# EAGLE design dice (EAGLE 5.11)
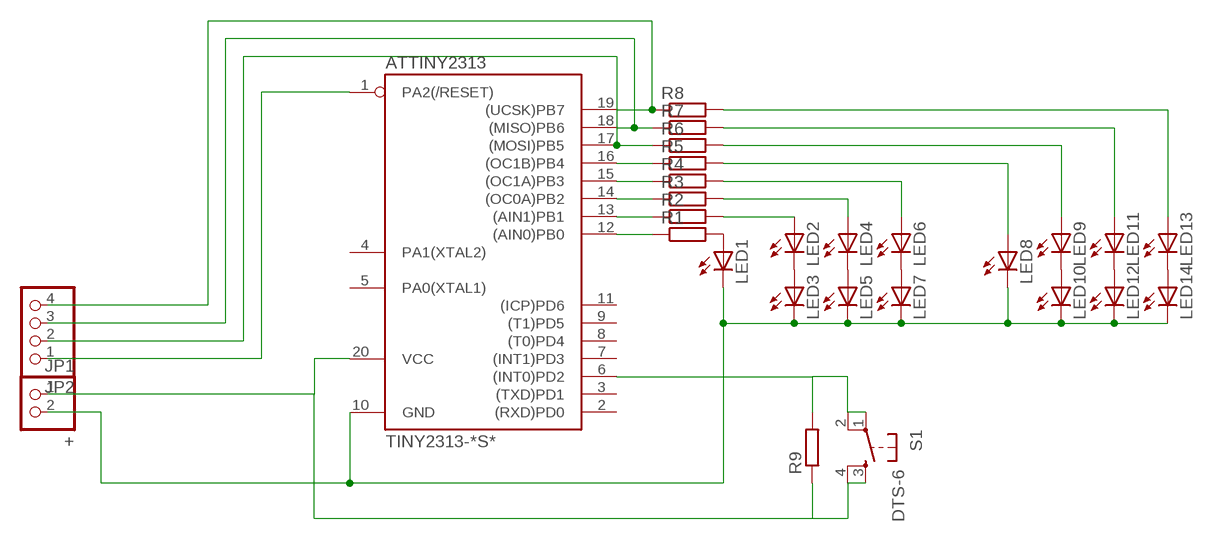
[diagram p0: schematic, sheet 1]

## Parts
ATTINY2313  TINY2313-*S*  [SO20L$]
JP1  +  PINHD-1X2/90  [1X02/90]
JP2  PINHD-1X4/90  [1X04/90]
LED1  LEDCHIPLED_1206  [CHIPLED_1206]
LED2  LEDCHIPLED_1206  [CHIPLED_1206]
LED3  LEDCHIPLED_1206  [CHIPLED_1206]
LED4  LEDCHIPLED_1206  [CHIPLED_1206]
LED5  LEDCHIPLED_1206  [CHIPLED_1206]
LED6  LEDCHIPLED_1206  [CHIPLED_1206]
LED7  LEDCHIPLED_1206  [CHIPLED_1206]
LED8  LEDCHIPLED_1206  [CHIPLED_1206]
LED9  LEDCHIPLED_1206  [CHIPLED_1206]
LED10  LEDCHIPLED_1206  [CHIPLED_1206]
LED11  LEDCHIPLED_1206  [CHIPLED_1206]
LED12  LEDCHIPLED_1206  [CHIPLED_1206]
LED13  LEDCHIPLED_1206  [CHIPLED_1206]
LED14  LEDCHIPLED_1206  [CHIPLED_1206]
R1  R-EU_R0402  [R0402]
R2  R-EU_R0402  [R0402]
R3  R-EU_R0402  [R0402]
R4  R-EU_R0402  [R0402]
R5  R-EU_R0402  [R0402]
R6  R-EU_R0402  [R0402]
R7  R-EU_R0402  [R0402]
R8  R-EU_R0402  [R0402]
R9  R-EU_0207/10  [0207/10]
S1  DTS-6  [DTS-6]

## Nets
+5V: ATTINY2313.20(VCC) JP1.1 R9.1 S1.3 S1.4
N$1: ATTINY2313.12((AIN0)PB0) R1.1
N$2: ATTINY2313.13((AIN1)PB1) R2.1
N$3: ATTINY2313.14((OC0A)PB2) R3.1
N$4: ATTINY2313.15((OC1A)PB3) R4.1
N$5: ATTINY2313.16((OC1B)PB4) R5.1
N$7: ATTINY2313.18((MISO)PB6) JP2.3 R7.1
N$8: ATTINY2313.19((UCSK)PB7) JP2.4 R8.1
N$9: LED1.A R1.2
N$10: LED2.C LED3.A
N$11: LED4.C LED5.A
N$12: LED6.C LED7.A
N$13: LED2.A R2.2
N$14: LED4.A R3.2
N$15: LED6.A R4.2
N$16: ATTINY2313.6((INT0)PD2) R9.2 S1.1 S1.2
N$17: LED9.C LED10.A
N$18: LED11.C LED12.A
N$19: LED13.C LED14.A
N$20: LED8.A R5.2
N$21: LED9.A R6.2
N$22: LED11.A R7.2
N$23: LED13.A R8.2
N$24: ATTINY2313.10(GND) JP1.2 LED1.C LED3.C LED5.C LED7.C LED8.C LED10.C LED12.C LED14.C
N$25: ATTINY2313.17((MOSI)PB5) JP2.2 R6.1
N$26: ATTINY2313.1(PA2(/RESET)) JP2.1
Unconnected: ATTINY2313.2((RXD)PD0) ATTINY2313.3((TXD)PD1) ATTINY2313.4(PA1(XTAL2)) ATTINY2313.5(PA0(XTAL1)) ATTINY2313.7((INT1)PD3) ATTINY2313.8((T0)PD4) ATTINY2313.9((T1)PD5) ATTINY2313.11((ICP)PD6)

## Library data of the parts
ATTINY2313 = avr-6:TINY2313*: Atmel Tiny2313 2K Flash, 128 bytes EEPROM, 128 bytes RAM
JP1 = pinhead:PINHD-1X2: PIN HEADER
JP2 = pinhead:PINHD-1X4: PIN HEADER
LED1-LED14 = led:LED: LED OSRAM: - CHIPLED LG R971, LG N971, LY N971, LG Q971, LY Q971, LO R971, LY R971 LH N974, LH R974 LS Q976, LO Q976, LY Q976 LO Q996 - Hyper CHIPLED LW Q18S LB Q993, LB Q99A, LB R99A - SideLED LS A670, LO A670, LY A670, LG A670, LP A670 LB A673, LV A673, LT A673, LW A673 LH A674 LY A675 LS A676, LA A676, LO A676, LY A676, LW A676 LS A679, LY A679, LG A679 - Hyper Micro SIDELED® LS Y876, LA Y876, LO Y876, LY Y876 LT Y87S - SmartLED LW L88C, LW L88S LB L89C, LB L89S, LG L890 LS L89K, LO L89K, LY L89K LS L896, LA L896, LO L896, LY L896 - TOPLED LS T670, LO T670, LY T670, LG T670, LP T670 LSG T670, LSP T670, LSY T670, LOP T670, LYG T670 LG T671, LOG T671, LSG T671 LB T673, LV T673, LT T673, LW T673 LH T674 LS T676, LA T676, LO T676, LY T676, LB T676, LH T676, LSB T676, LW T676 LB T67C, LV T67C, LT T67C, LS T67K, LO T67K, LY T67K, LW E67C LS E67B, LA E67B, LO E67B, LY E67B, LB E67C, LV E67C, LT E67C LW T67C LS T679, LY T679, LG T679 LS T770, LO T770, LY T770, LG T770, LP T770 LB T773, LV T773, LT T773, LW T773 LH T774 LS E675, LA E675, LY E675, LS T675 LS T776, LA T776, LO T776, LY T776, LB T776 LHGB T686 LT T68C, LB T68C - Hyper Mini TOPLED® LB M676 - Mini TOPLED Santana® LG M470 LS M47K, LO M47K, LY M47K Source: http://www.osram.convergy.de LUXEON: - LUMILED® LXK2-PW12-R00, LXK2-PW12-S00, LXK2-PW14-U00, LXK2-PW14-V00 LXK2-PM12-R00, LXK2-PM12-S00, LXK2-PM14-U00 LXK2-PE12-Q00, LXK2-PE12-R00, LXK2-PE12-S00, LXK2-PE14-T00, LXK2-PE14-U00 LXK2-PB12-K00, LXK2-PB12-L00, LXK2-PB12-M00, LXK2-PB14-N00, LXK2-PB14-P00, LXK2-PB14-Q00 LXK2-PR12-L00, LXK2-PR12-M00, LXK2-PR14-Q00, LXK2-PR14-R00 LXK2-PD12-Q00, LXK2-PD12-R00, LXK2-PD12-S00 LXK2-PH12-R00, LXK2-PH12-S00 LXK2-PL12-P00, LXK2-PL12-Q00, LXK2-PL12-R00 Source: www.luxeon.com KINGBRIGHT: KA-3528ASYC Source: www.kingbright.com
R1-R9 = rcl:R-EU_: RESISTOR, European symbol
S1 = switch-tact:DTS-6

## Board
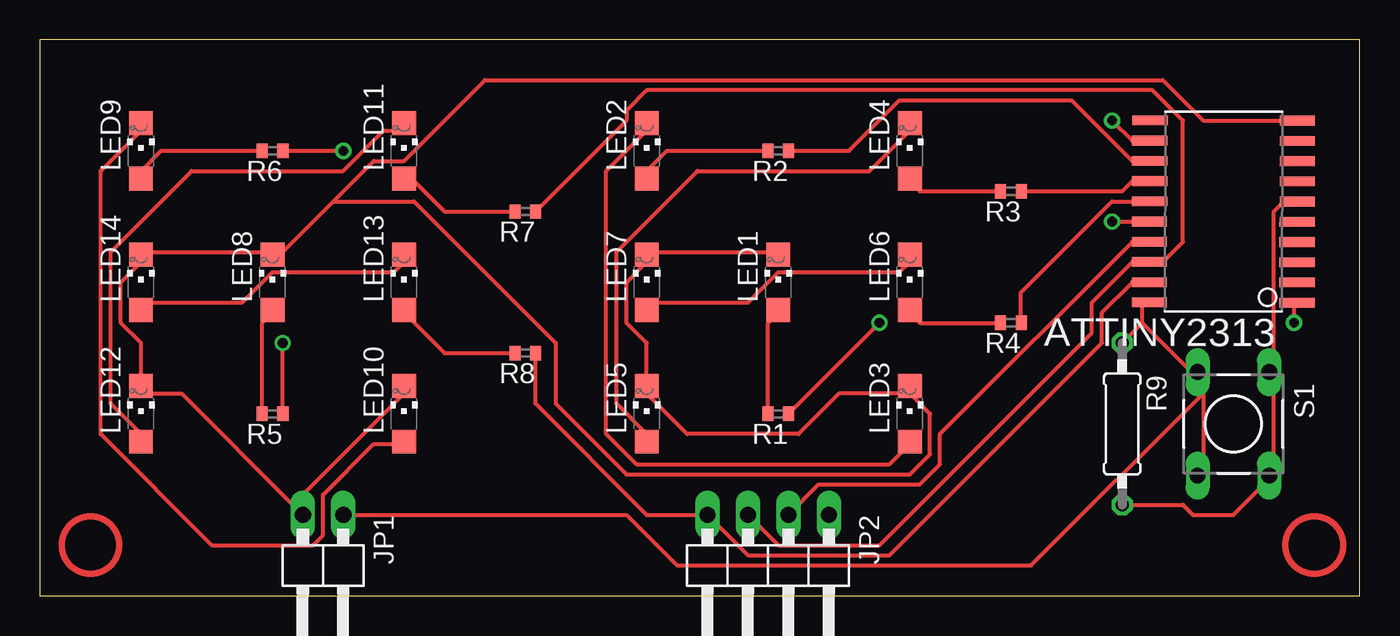
[diagram p1: board, top side]
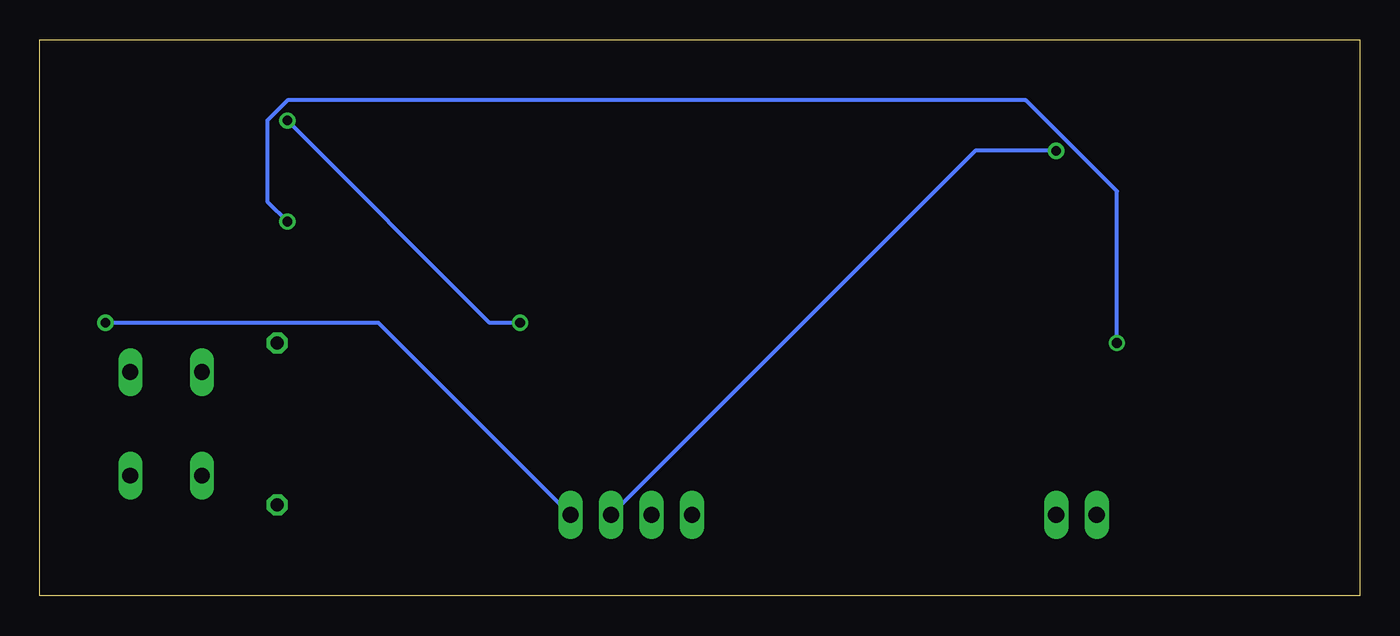
[diagram p2: board, bottom side, seen from below]

Size 82.86 x 34.91 mm. Coordinates in mm from the lower left corner, seen from the top.
Outline: 0,0 82.86,0 82.86,34.91 0,34.91 0,0
Copper layers (1*16): Top 0.035mm / dielectric 1.5mm / Bottom 0.035mm
Design rules "default": minimum track width 10mil, minimum drill 24mil, track to track 8mil, track to pad 8mil, pad to pad 8mil, via to via 8mil, smd to smd 8mil, copper to edge 40mil, drill to drill 8mil, minimum pad ring 10mil, minimum via ring 8mil, stop-mask expansion 4mil, vias tented up to drill 0mil, thermal gap 10mil

### Footprints (pad centres in the part's own frame; a part is rotated, then mirrored left to right if it is on the bottom)
SO20L$ = smd 0.61 x 2.21: 1 -5.715,-4.636; 2 -4.445,-4.636; 3 -3.175,-4.636; 4 -1.905,-4.636; 5 -0.635,-4.636; 6 0.635,-4.636; 7 1.905,-4.636; 8 3.175,-4.636; 9 4.445,-4.636; 10 5.715,-4.636; 11 5.715,4.61; 12 4.445,4.636; 13 3.175,4.636; 14 1.905,4.636; 15 0.635,4.636; 16 -0.635,4.636; 17 -1.905,4.636; 18 -3.175,4.636; 19 -4.445,4.636; 20 -5.715,4.636
1X02/90 = drill 1.016 long: 1 -1.27,-3.81; 2 1.27,-3.81
1X04/90 = drill 1.016 long: 1 -3.81,-3.81; 2 -1.27,-3.81; 3 1.27,-3.81; 4 3.81,-3.81
CHIPLED_1206 = smd 1.5 x 1.5: A 0,-1.75; C 0,1.75
R0402 = smd 0.7 x 0.9: 1 -0.65,0; 2 0.65,0
0207/10 = drill 0.813 octagon: 1 -5.08,0; 2 5.08,0
DTS-6 = drill 1 long: 1 -3.25,2.25; 2 3.25,2.25; 3 -3.25,-2.25; 4 3.25,-2.25

### Placement (x,y rotation side)
ATTINY2313  74.3,24.13 89.9 top
JP1  17.78,1.27 180 top
JP2  45.72,1.27 180 top
LED1  46.36,19.68 0 top
LED2  38.1,27.94 0 top
LED3  54.61,11.43 0 top
LED4  54.61,27.94 0 top
LED5  38.1,11.43 0 top
LED6  54.61,19.68 0 top
LED7  38.1,19.68 0 top
LED8  14.61,19.68 0 top
LED9  6.35,27.94 0 top
LED10  22.86,11.43 0 top
LED11  22.86,27.94 0 top
LED12  6.35,11.43 0 top
LED13  22.86,19.68 0 top
LED14  6.35,19.68 0 top
R1  46.36,11.43 180 top
R2  46.36,27.94 180 top
R3  60.96,25.4 180 top
R4  60.96,17.15 180 top
R5  14.61,11.43 180 top
R6  14.61,27.94 180 top
R7  30.48,24.13 180 top
R8  30.48,15.24 180 top
R9  67.95,10.79 270 top
S1  74.93,10.79 270 top

### Tracks (layer width: path | path; a pad name or v marks a point on that pad's centre or on a via)
+5V
  Top 0.254: 69.22,17.15 69.22,18.41 ATTINY2313.20 | 69.22,17.15 R9.1 | 73.03,12.7 73.03,13.97 S1.3 | 73.03,12.7 73.03,7.62 S1.4 | JP1.1 36.83,5.08 40,1.91 62.23,1.91 73.03,12.7 | 73.03,12.7 S1.3 | 69.22,17.15 72.39,13.97 S1.3
N$1  (via drill 0.61)
  Top 0.254: v52.7,17.15 46.99,11.43 R1.1 | v67.31,29.84 68.58,28.57 69.22,28.57 ATTINY2313.12
  Bottom 0.254: v52.7,17.15 54.61,17.15 v67.31,29.84
N$2
  Top 0.254: 46.99,27.94 R2.1 50.8,27.94 53.98,31.12 64.77,31.12 68.58,27.3 69.22,27.3 ATTINY2313.13
N$3
  Top 0.254: 61.59,25.4 R3.1 67.95,25.4 68.58,26.04 69.22,26.04 ATTINY2313.14
N$4
  Top 0.254: R4.1 61.59,17.15 61.59,19.05 67.31,24.76 69.22,24.76 ATTINY2313.15
N$5  (via drill 0.61)
  Top 0.254: v15.24,15.88 15.24,11.43 R5.1 | v67.31,23.49 69.22,23.49 ATTINY2313.16
  Bottom 0.254: v15.24,15.88 15.24,25.4 20.96,31.12 67.31,31.12 68.58,29.84 68.58,24.76 v67.31,23.49
N$7
  Top 0.254: R7.1 36.83,29.84 36.83,30.48 38.1,31.75 69.85,31.75 71.76,29.84 71.76,22.23 70.48,20.95 69.85,20.95 ATTINY2313.18 69.22,20.95 68.58,20.95 66.04,18.41 66.04,16.51 52.7,3.17 46.36,3.17 JP2.3
N$8
  Top 0.254: R8.1 31.11,12.06 38.1,5.08 JP2.4 44.45,2.54 53.34,2.54 66.67,15.88 66.67,17.78 68.58,19.68 69.22,19.68 ATTINY2313.19
N$9
  Top 0.254: R1.2 45.72,11.43 45.72,17.15 46.36,17.78 LED1.A
N$10
  Top 0.254: LED2.C 38.1,29.21 35.56,26.67 35.56,10.16 37.47,8.25 53.34,8.25 54.61,9.52 LED3.A
N$11
  Top 0.254: LED5.A 38.1,10.16 36.2,12.06 36.2,21.59 41.28,26.67 52.07,26.67 54.61,29.21 LED4.C
N$12
  Top 0.254: LED7.A 38.1,18.41 44.45,18.41 46.36,20.32 53.98,20.32 54.61,20.95 LED6.C
N$13
  Top 0.254: 45.72,27.94 R2.2 39.37,27.94 38.1,26.67 LED2.A
N$14
  Top 0.254: 60.33,25.4 R3.2 55.25,25.4 54.61,26.04 LED4.A
N$15
  Top 0.254: 60.33,17.15 R4.2 55.25,17.15 54.61,17.78 LED6.A
N$16
  Top 0.254: R9.2 71.76,5.71 72.39,5.08 74.93,5.08 76.84,6.98 S1.2 77.47,7.62 77.47,13.97 S1.1 77.47,14.6 77.47,24.13 78.11,24.76 78.74,24.76 ATTINY2313.6
N$17
  Top 0.254: LED9.C 6.35,29.21 3.81,26.67 3.81,10.16 10.8,3.17 17.14,3.17 17.78,3.81 17.78,6.35 20.96,9.52 22.86,9.52 LED10.A
N$18
  Top 0.254: LED12.A 6.35,10.16 4.45,12.06 4.45,21.59 9.53,26.67 19.05,26.67 21.59,29.21 22.86,29.21 LED11.C
N$19
  Top 0.254: LED14.A 6.35,18.41 12.7,18.41 14.61,20.32 22.22,20.32 22.86,20.95 LED13.C
N$20
  Top 0.254: R5.2 13.97,11.43 13.97,17.15 14.61,17.78 LED8.A
N$21
  Top 0.254: 13.97,27.94 R6.2 7.62,27.94 6.35,26.67 LED9.A
N$22
  Top 0.254: R7.2 25.4,24.13 22.86,26.67 LED11.A
N$23
  Top 0.254: R8.2 25.4,15.24 22.86,17.78 LED13.A
N$24
  Top 0.254: LED1.C 46.36,21.59 38.1,21.59 LED7.C 38.1,20.95 36.83,19.68 36.83,17.15 38.1,15.88 LED5.C 38.1,12.7 40.64,10.16 47.62,10.16 50.17,12.7 54.61,12.7 | 15.88,5.71 8.89,12.7 6.35,12.7 LED12.C 6.35,15.88 5.08,17.15 5.08,19.68 6.35,20.95 LED14.C 6.35,21.59 14.61,21.59 LED8.C 14.61,20.95 18.42,24.76 | 15.88,5.71 22.86,12.7 LED10.C | 15.88,5.71 JP1.2 | 18.42,24.76 20.96,27.3 22.86,27.3 27.94,32.38 70.48,32.38 73.03,29.84 78.74,29.84 ATTINY2313.10 | 54.61,12.7 55.88,11.43 55.88,8.89 54.61,7.62 36.83,7.62 32.39,12.06 32.39,15.88 23.5,24.76 18.42,24.76 | 54.61,12.7 LED3.C
N$25  (via drill 0.61)
  Top 0.254: JP2.2 48.9,6.98 55.25,6.98 56.52,8.25 56.52,10.16 68.58,22.23 69.22,22.23 ATTINY2313.17 | v19.05,27.94 R6.1 15.24,27.94
  Bottom 0.254: v19.05,27.94 24.13,27.94 JP2.2
N$26  (via drill 0.61)
  Top 0.254: v78.74,17.15 78.74,18.41 ATTINY2313.1
  Bottom 0.254: v78.74,17.15 61.59,17.15 JP2.1
(copper drawn outside any net)
  shapes: Top circle x2